# Altium schematic sheet XT60_Bus.SchDoc
size A4
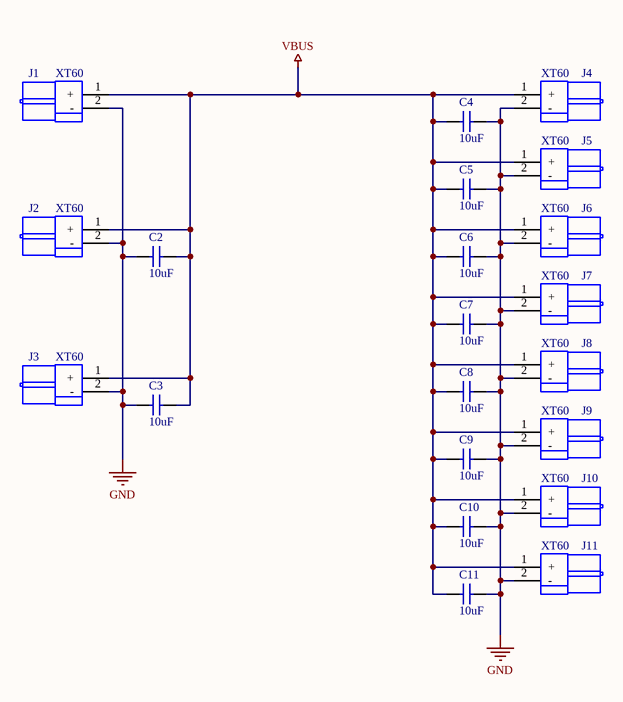
[diagram p0: XT60_Bus.SchDoc]

## Parts
C2  value 10uF  [1210_Capacitor]  (hidden comment: C_1210_10uF)
C3  value 10uF  [1210_Capacitor]  (hidden comment: C_1210_10uF)
C4  value 10uF  [1210_Capacitor]  (hidden comment: C_1210_10uF)
C5  value 10uF  [1210_Capacitor]  (hidden comment: C_1210_10uF)
C6  value 10uF  [1210_Capacitor]  (hidden comment: C_1210_10uF)
C7  value 10uF  [1210_Capacitor]  (hidden comment: C_1210_10uF)
C8  value 10uF  [1210_Capacitor]  (hidden comment: C_1210_10uF)
C9  value 10uF  [1210_Capacitor]  (hidden comment: C_1210_10uF)
C10  value 10uF  [1210_Capacitor]  (hidden comment: C_1210_10uF)
C11  value 10uF  [1210_Capacitor]  (hidden comment: C_1210_10uF)
J1  XT60  [J_XT60_Thru_Female]
J2  XT60  [J_XT60_Thru_Female]
J3  XT60  [J_XT60_Thru_Female]
J4  XT60  [J_XT60_Thru_Male]
J5  XT60  [J_XT60_Thru_Male]
J6  XT60  [J_XT60_Thru_Male]
J7  XT60  [J_XT60_Thru_Male]
J8  XT60  [J_XT60_Thru_Male]
J9  XT60  [J_XT60_Thru_Male]
J10  XT60  [J_XT60_Thru_Male]
J11  XT60  [J_XT60_Thru_Male]

## Nets
GND: C2.1 C3.1 C4.2 C5.2 C6.2 C7.2 C8.2 C9.2 C10.2 C11.2 J1.2(-) J2.2(-) J3.2(-) J4.2(-) J5.2(-) J6.2(-) J7.2(-) J8.2(-) J9.2(-) J10.2(-) J11.2(-)
VBUS: C2.2 C3.2 C4.1 C5.1 C6.1 C7.1 C8.1 C9.1 C10.1 C11.1 J1.1(+) J2.1(+) J3.1(+) J4.1(+) J5.1(+) J6.1(+) J7.1(+) J8.1(+) J9.1(+) J10.1(+) J11.1(+)

## Library data of the parts
C2-C11 = C_1210_10uF: CAP CER 10UF 50V 10% X5R 1210; Manufacturer: Taiyo Yuden; Manufacturer PN: UMK325BJ106KM-T; SVP Creator: Matt Rogge; Package: 1210; Supplier 1: Digi-Key; Supplier Part Number 1: 587-2247-1-ND
J1-J11 = J_XT60: 60 Amp XT60 Connector